# Altium schematic sheet Channels [3,4].SchDoc
size A4; DocumentNumber: 4; SheetNumber: 4; SheetTotal: 11
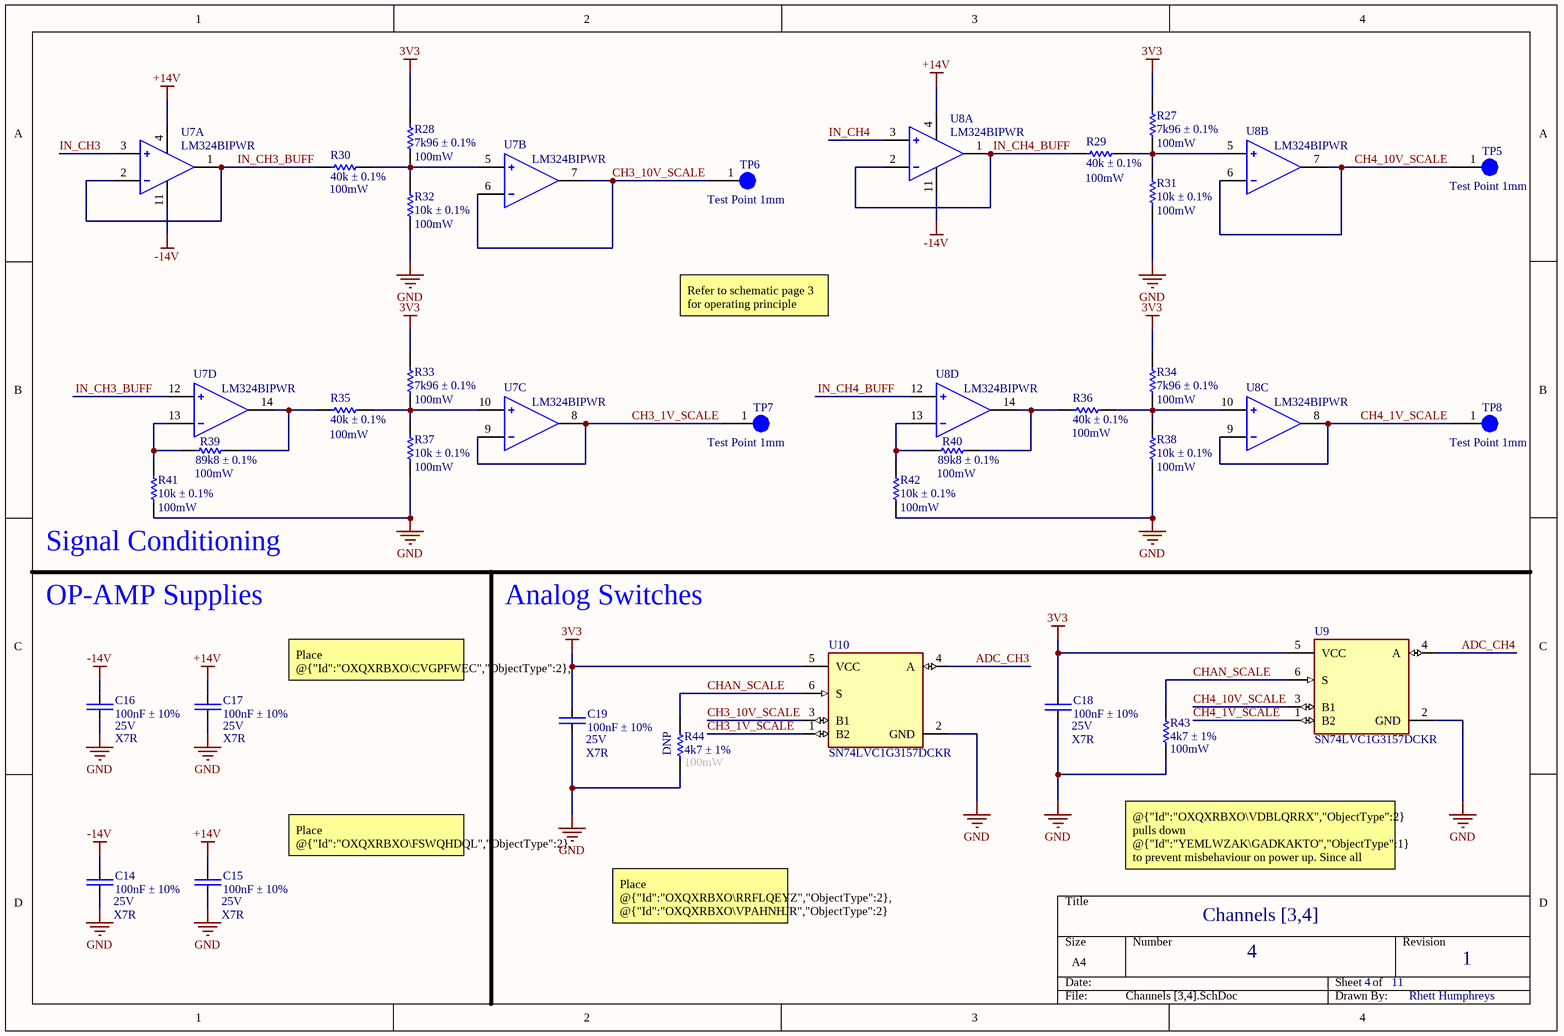
[diagram p0: Channels [3,4].SchDoc]

## Parts
C14  100nF ± 10%  [CAP-0603]
C15  100nF ± 10%  [CAP-0603]
C16  100nF ± 10%  [CAP-0603]
C17  100nF ± 10%  [CAP-0603]
C18  100nF ± 10%  [CAP-0603]
C19  100nF ± 10%  [CAP-0603]
R27  7k96 ± 0.1%  [RES-0603]
R28  7k96 ± 0.1%  [RES-0603]
R29  40k ± 0.1%  [RES-0603]
R30  40k ± 0.1%  [RES-0603]
R31  10k ± 0.1%  [RES-0603]
R32  10k ± 0.1%  [RES-0603]
R33  7k96 ± 0.1%  [RES-0603]
R34  7k96 ± 0.1%  [RES-0603]
R35  40k ± 0.1%  [RES-0603]
R36  40k ± 0.1%  [RES-0603]
R37  10k ± 0.1%  [RES-0603]
R38  10k ± 0.1%  [RES-0603]
R39  89k8 ± 0.1%  [RES-0603]
R40  89k8 ± 0.1%  [RES-0603]
R41  10k ± 0.1%  [RES-0603]
R42  10k ± 0.1%  [RES-0603]
R43  4k7 ± 1%  [RES-0603]
R44  4k7 ± 1%  [RES-0603]
TP5  Test Point 1mm  [Test Point 1mm]
TP6  Test Point 1mm  [Test Point 1mm]
TP7  Test Point 1mm  [Test Point 1mm]
TP8  Test Point 1mm  [Test Point 1mm]
U7  LM324BIPWR  [FP-PW0014A-MFG]  (parts A,B,C,D of 4)
U8  LM324BIPWR  [FP-PW0014A-MFG]  (parts A,B,C,D of 4)
U9  SN74LVC1G3157DCKR  [FP-DCK0006A-IPC_B]
U10  SN74LVC1G3157DCKR  [FP-DCK0006A-IPC_B]

## Nets
3V3: C18.2 C19.2 R27.1 R28.1 R33.1 R34.1 U9.5(VCC) U10.5(VCC)
+14V: C15.2 C17.2 U7.4(VCC+) U8.4(VCC+)
-14V: C14.2 C16.2 U7.11(VCC-) U8.11(VCC-)
GND: C14.1 C15.1 C16.1 C17.1 C18.1 C19.1 R31.2 R32.2 R37.2 R38.2 R41.2 R42.2 R43.2 R44.2 U9.2(GND) U10.2(GND)
ADC_CH3: U10.4(A)
ADC_CH4: U9.4(A)
CH3_1V_SCALE: TP7.1 U7.8(3OUT) U7.9(3IN-) U10.1(B2)
CH3_10V_SCALE: TP6.1 U7.6(2IN-) U7.7(2OUT) U10.3(B1)
CH4_1V_SCALE: TP8.1 U8.8(3OUT) U8.9(3IN-) U9.1(B2)
CH4_10V_SCALE: TP5.1 U8.6(2IN-) U8.7(2OUT) U9.3(B1)
CHAN_SCALE: R43.1 R44.1 U9.6(S) U10.6(S)
IN_CH3: U7.3(1IN+)
IN_CH3_BUFF: R30.2 U7.1(1OUT) U7.2(1IN-) U7.12(4IN+)
IN_CH4: U8.3(1IN+)
IN_CH4_BUFF: R29.2 U8.1(1OUT) U8.2(1IN-) U8.12(4IN+)
NetR27_2: R27.2 R29.1 R31.1 U8.5(2IN+)
NetR28_2: R28.2 R30.1 R32.1 U7.5(2IN+)
NetR33_2: R33.2 R35.1 R37.1 U7.10(3IN+)
NetR34_2: R34.2 R36.1 R38.1 U8.10(3IN+)
NetR35_2: R35.2 R39.1 U7.14(4OUT)
NetR36_2: R36.2 R40.1 U8.14(4OUT)
NetR39_2: R39.2 R41.1 U7.13(4IN-)
NetR40_2: R40.2 R42.1 U8.13(4IN-)

## Notes on the sheet
- (near R28) 100mW
- (near R29) 100mW
- (near R27) 100mW
- (near R30) 100mW
- (near R32) 100mW
- (near R31) 100mW
- Refer to schematic page 3 for operating principle
- (near R35) 100mW
- (near R33) 100mW
- (near R36) 100mW
- (near R34) 100mW
- (near R41) 100mW
- (near R39) 100mW
- (near R37) 100mW
- (near R42) 100mW
- (near R40) 100mW
- (near R38) 100mW
- (near R41) Signal Conditioning
- OP-AMP Supplies
- Analog Switches
- Place @{"Id":"OXQXRBXO\CVGPFWEC","ObjectType":2}, @{"Id":"OXQXRBXO\LDTQUHWN","ObjectType":2} as close as possible to @{"Id":"OXQXRBXO\LRRSIIMD","ObjectType":2}
- (near C16) X7R
- (near C16) 25V
- (near C17) X7R
- (near C17) 25V
- (near C19) X7R
- (near C19) 25V
- (near R44) DNP
- (near R44) 100mW
- (near C18) X7R
- (near C18) 25V
- (near R43) 100mW
- Place @{"Id":"OXQXRBXO\FSWQHDQL","ObjectType":2}, @{"Id":"OXQXRBXO\CJOMIWQG","ObjectType":2} as close as possible to @{"Id":"OXQXRBXO\YXPBCDIN","ObjectType":2}
- (near C14) X7R
- (near C14) 25V
- (near C15) X7R
- (near C15) 25V
- Place @{"Id":"OXQXRBXO\RRFLQEYZ","ObjectType":2}, @{"Id":"OXQXRBXO\VPAHNHJR","ObjectType":2} as close as possible to @{"Id":"OXQXRBXO\QNTGGKSR","ObjectType":2}, @{"Id":"OXQXRBXO\MYBQOZMJ","ObjectType":2} respectively
- @{"Id":"OXQXRBXO\VDBLQRRX","ObjectType":2} pulls down @{"Id":"YEMLWZAK\GADKAKTO","ObjectType":1} to prevent misbehaviour on power up. Since all switches share @{"Id":"YEMLWZAK\GADKAKTO","ObjectType":1} only one pull down should be populated (rest are DNP)
- Channels [3,4]
- 4
- 11
- 1
- Rhett Humphreys

## Library data of the parts
C14-C19 = CAP-0603: Capacitor chip unpolarized. 0603
R27-R44 = RES-0603: Resistor chip. 0603
U7 U8 = CMP-00370-131314463-1: LM324BIPWR Quad, 36-V, 1.2-MHz 3-mV offset voltage operational amplifier 14-TSSOP -40 to 85; Manufacturer Lifecycle Status: ACTIVE; Number of Pins: 14; NexarPartId: 131314463; Height: 1.2mm; Thickness: 1mm; Length: 5mm; Lifecycle Status: Production; Width: 4.4mm; Case/Package: TSSOP
U9 U10 = CMP-0859-00516-4: IC SWITCH SPDT SC70-6; Nominal Supply Current: 10uA; Number of Inputs: 1; Supply Type: Single; Operating Supply Current: 1uA; Polarity: Non-Inverting; Low Level Output Current: 128mA; Bandwidth: 300MHz; Max Supply Voltage: 5.5V; Turn-Off Delay Time: 3.8ns; Turn-On Delay Time: 5.7ns; Number of Outputs: 2; Min Supply Voltage: 1.65V; Propagation Delay: 300ps; On-State Resistance: 15R; Mount: Surface Mount; Throw Configuration: SPDT; Min Operating Temperature: -40°C; Radiation Hardening: No; Number of Pins: 6; Case/Package: SC; Length: 2mm; Lead Free: Lead Free; REACH SVHC: No SVHC; Termination: SMD/SMT; High Level Output Current: 128mA; Height: 0.9mm; Weight: 8.8E-05oz; Package Quantity: 3000; Number of Channels: 1; Packaging: Tape and Reel; Number of Bits: 1; Width: 1.25mm; Max Operating Temperature: 125°C; Max Supply Current: 10uA; Contact Plating: Gold; RoHS Compliant: Yes